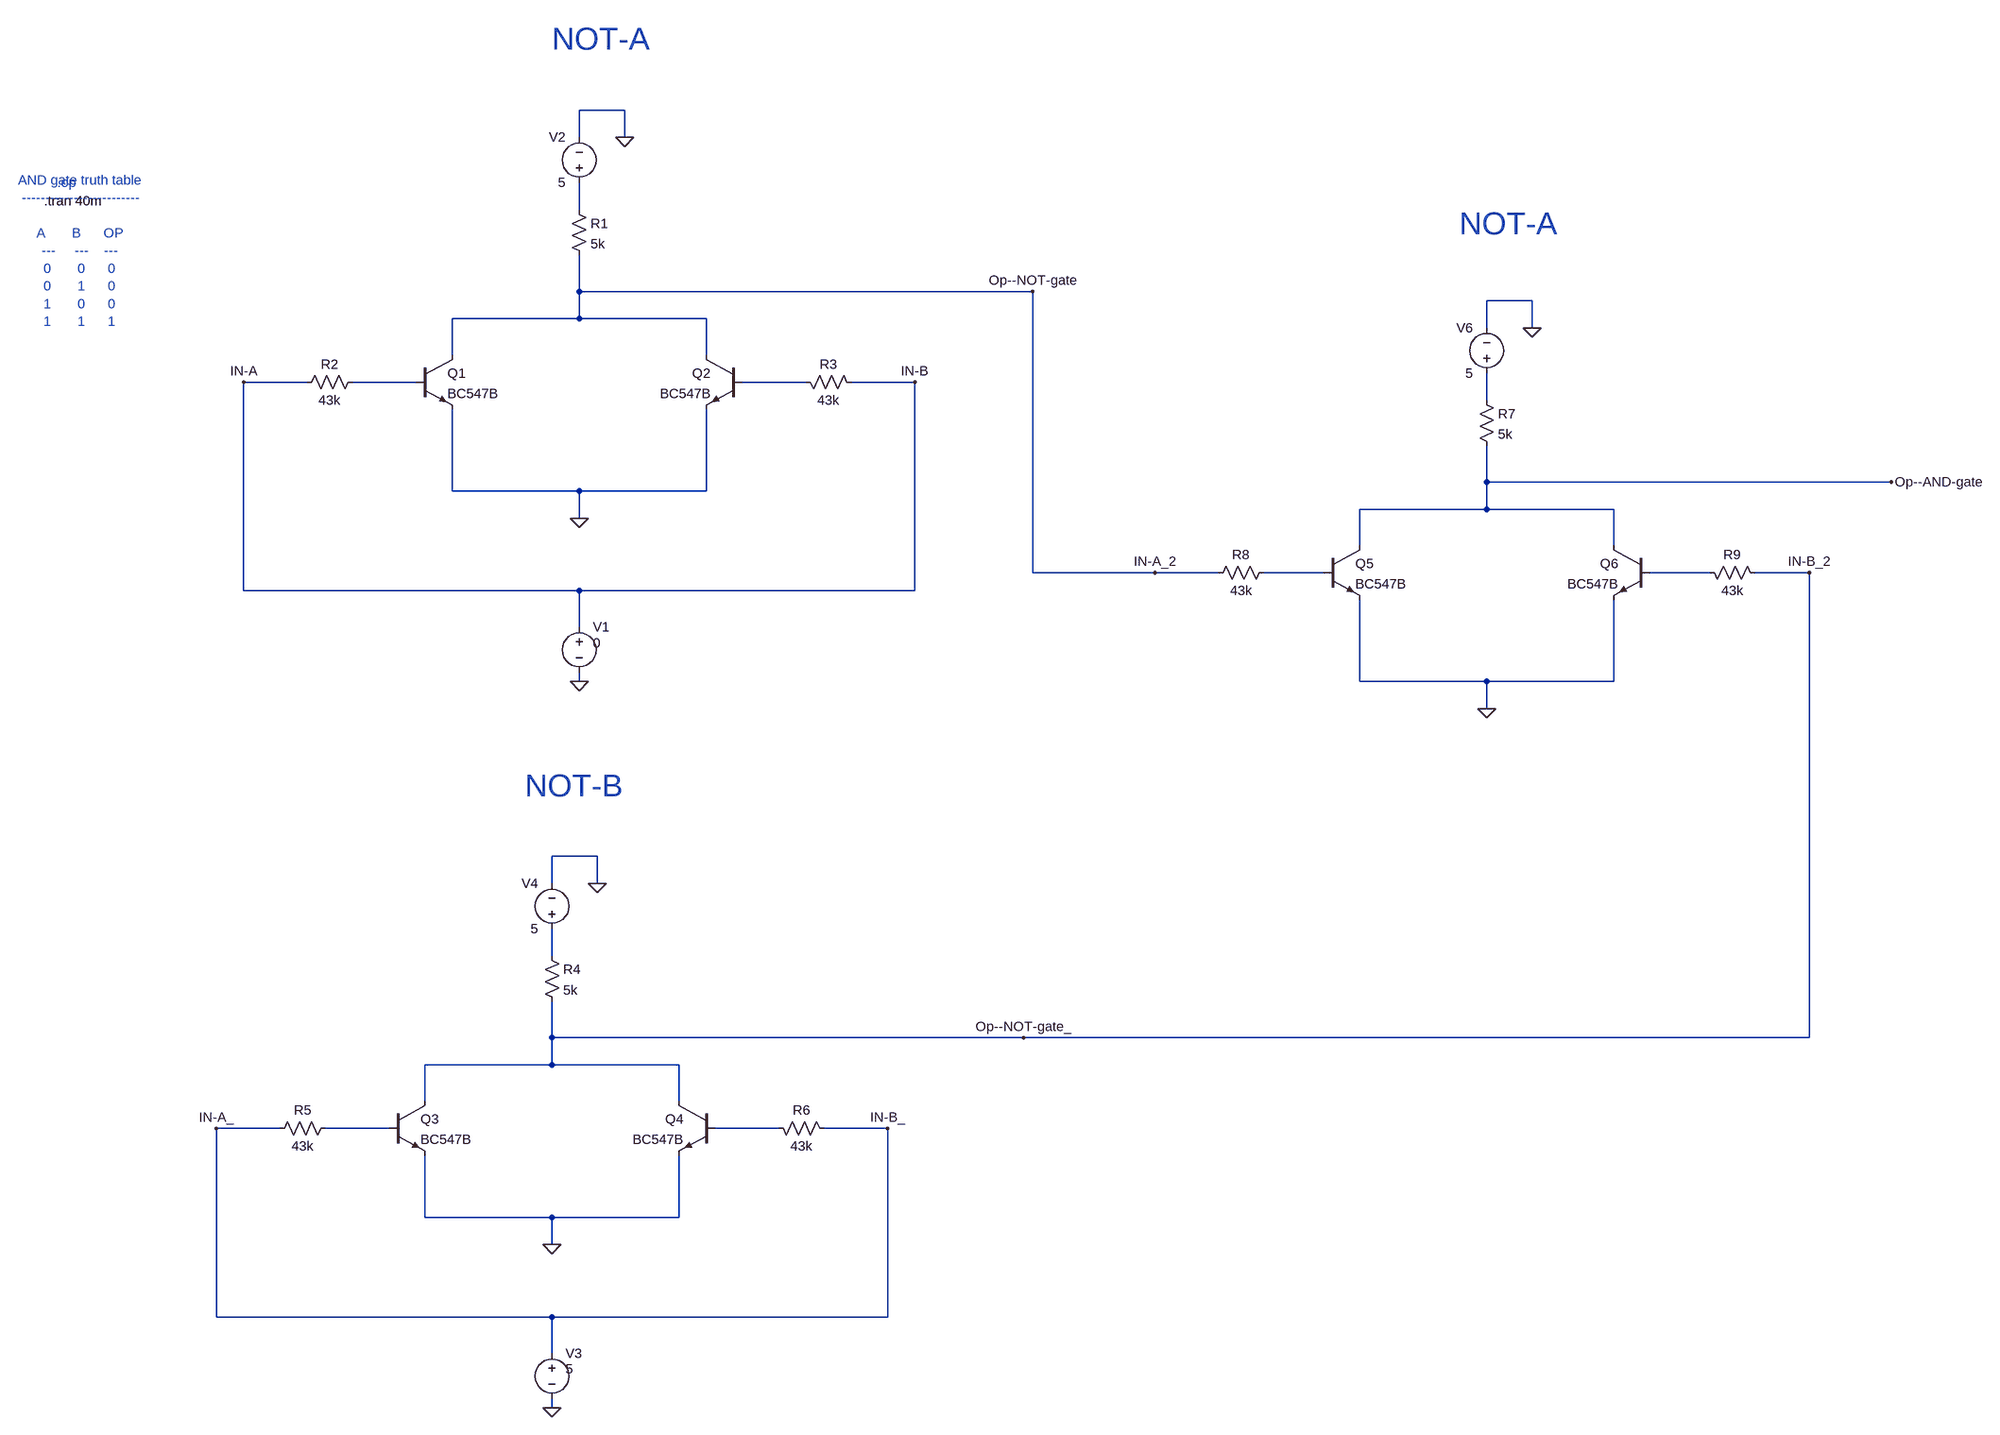
[diagram p0: schematic AND_using_NOR_gate.asc]
AND_using_NOR_gate.asc, the LTspice schematic file:
Version 4.1
SHEET 1 3684 2276
WIRE 656 -80 576 -80
WIRE 576 -32 576 -80
WIRE 656 -32 656 -80
WIRE 576 96 576 48
WIRE 576 240 576 176
WIRE 1376 240 576 240
WIRE 2752 256 2672 256
WIRE 576 288 576 240
WIRE 576 288 352 288
WIRE 800 288 576 288
WIRE 2672 304 2672 256
WIRE 2752 304 2752 256
WIRE 352 352 352 288
WIRE 800 352 800 288
WIRE 96 400 -16 400
WIRE 288 400 176 400
WIRE 976 400 864 400
WIRE 1168 400 1056 400
WIRE 2672 432 2672 384
WIRE 2672 576 2672 512
WIRE 3504 576 2672 576
WIRE 352 592 352 448
WIRE 576 592 352 592
WIRE 800 592 800 448
WIRE 800 592 576 592
WIRE 2672 624 2672 576
WIRE 2672 624 2448 624
WIRE 2896 624 2672 624
WIRE 576 640 576 592
WIRE 2448 688 2448 624
WIRE 2896 688 2896 624
WIRE 1376 736 1376 240
WIRE 2080 736 1376 736
WIRE 2192 736 2080 736
WIRE 2384 736 2272 736
WIRE 3072 736 2960 736
WIRE 3248 736 3152 736
WIRE -16 768 -16 400
WIRE 576 768 -16 768
WIRE 1168 768 1168 400
WIRE 1168 768 576 768
WIRE 576 832 576 768
WIRE 576 928 576 912
WIRE 2448 928 2448 784
WIRE 2672 928 2448 928
WIRE 2896 928 2896 784
WIRE 2896 928 2672 928
WIRE 2672 976 2672 928
WIRE 608 1248 528 1248
WIRE 528 1296 528 1248
WIRE 608 1296 608 1248
WIRE 528 1424 528 1376
WIRE 528 1568 528 1504
WIRE 1360 1568 528 1568
WIRE 3248 1568 3248 736
WIRE 3248 1568 1360 1568
WIRE 528 1616 528 1568
WIRE 528 1616 304 1616
WIRE 752 1616 528 1616
WIRE 304 1680 304 1616
WIRE 752 1680 752 1616
WIRE 48 1728 -64 1728
WIRE 240 1728 128 1728
WIRE 928 1728 816 1728
WIRE 1120 1728 1008 1728
WIRE 304 1920 304 1776
WIRE 528 1920 304 1920
WIRE 752 1920 752 1776
WIRE 752 1920 528 1920
WIRE 528 1968 528 1920
WIRE -64 2096 -64 1728
WIRE 528 2096 -64 2096
WIRE 1120 2096 1120 1728
WIRE 1120 2096 528 2096
WIRE 528 2160 528 2096
WIRE 528 2256 528 2240
FLAG -16 400 IN-A
FLAG 576 928 0
FLAG 1168 400 IN-B
FLAG 576 640 0
FLAG 656 -32 0
FLAG 1376 240 Op--NOT-gate
FLAG -64 1728 IN-A_
FLAG 528 2256 0
FLAG 1120 1728 IN-B_
FLAG 528 1968 0
FLAG 608 1296 0
FLAG 1360 1568 Op--NOT-gate_
FLAG 2080 736 IN-A_2
FLAG 3248 736 IN-B_2
FLAG 2672 976 0
FLAG 2752 304 0
FLAG 3504 576 Op--AND-gate
SYMBOL voltage 576 816 R0
WINDOW 3 24 44 Left 2
WINDOW 123 0 0 Left 0
WINDOW 39 0 0 Left 0
SYMATTR Value 0
SYMATTR InstName V1
SYMBOL npn 288 352 R0
SYMATTR InstName Q1
SYMATTR Value BC547B
SYMBOL voltage 576 64 R180
WINDOW 0 24 96 Left 2
WINDOW 3 24 16 Left 2
WINDOW 123 0 0 Left 0
WINDOW 39 0 0 Left 0
SYMATTR InstName V2
SYMATTR Value 5
SYMBOL res 560 80 R0
SYMATTR InstName R1
SYMATTR Value 5k
SYMBOL res 192 384 R90
WINDOW 0 0 56 VBottom 2
WINDOW 3 32 56 VTop 2
SYMATTR InstName R2
SYMATTR Value 43k
SYMBOL npn 864 352 M0
SYMATTR InstName Q2
SYMATTR Value BC547B
SYMBOL res 960 384 M90
WINDOW 0 0 56 VBottom 2
WINDOW 3 32 56 VTop 2
SYMATTR InstName R3
SYMATTR Value 43k
SYMBOL voltage 528 2144 R0
WINDOW 3 24 44 Left 2
WINDOW 123 0 0 Left 0
WINDOW 39 0 0 Left 0
SYMATTR Value 5
SYMATTR InstName V3
SYMBOL npn 240 1680 R0
SYMATTR InstName Q3
SYMATTR Value BC547B
SYMBOL voltage 528 1392 R180
WINDOW 0 24 96 Left 2
WINDOW 3 24 16 Left 2
WINDOW 123 0 0 Left 0
WINDOW 39 0 0 Left 0
SYMATTR InstName V4
SYMATTR Value 5
SYMBOL res 512 1408 R0
SYMATTR InstName R4
SYMATTR Value 5k
SYMBOL res 144 1712 R90
WINDOW 0 0 56 VBottom 2
WINDOW 3 32 56 VTop 2
SYMATTR InstName R5
SYMATTR Value 43k
SYMBOL npn 816 1680 M0
SYMATTR InstName Q4
SYMATTR Value BC547B
SYMBOL res 912 1712 M90
WINDOW 0 0 56 VBottom 2
WINDOW 3 32 56 VTop 2
SYMATTR InstName R6
SYMATTR Value 43k
SYMBOL npn 2384 688 R0
SYMATTR InstName Q5
SYMATTR Value BC547B
SYMBOL voltage 2672 400 R180
WINDOW 0 24 96 Left 2
WINDOW 3 24 16 Left 2
WINDOW 123 0 0 Left 0
WINDOW 39 0 0 Left 0
SYMATTR InstName V6
SYMATTR Value 5
SYMBOL res 2656 416 R0
SYMATTR InstName R7
SYMATTR Value 5k
SYMBOL res 2288 720 R90
WINDOW 0 0 56 VBottom 2
WINDOW 3 32 56 VTop 2
SYMATTR InstName R8
SYMATTR Value 43k
SYMBOL npn 2960 688 M0
SYMATTR InstName Q6
SYMATTR Value BC547B
SYMBOL res 3056 720 M90
WINDOW 0 0 56 VBottom 2
WINDOW 3 32 56 VTop 2
SYMATTR InstName R9
SYMATTR Value 43k
TEXT -800 80 Left 2 !.tran 40m
TEXT -776 48 Left 2 ;.op
TEXT -736 168 Center 2 ;AND gate truth table\n-------------------------\n \nA       B      OP\n---     ---    ---\n0       0      0\n0       1      0\n1       0      0\n1       1      1
TEXT 528 -216 Left 5 ;NOT-A
TEXT 480 1112 Left 5 ;NOT-B
TEXT 2624 120 Left 5 ;NOT-A

The netlist it stands for:
* AND_using_NOR_gate.asc
V1 IN-B 0 0
Q1 IN-A_2 N002 0 0 BC547B
V2 N001 0 5
R1 N001 IN-A_2 5k
R2 N002 IN-B 43k
Q2 IN-A_2 N003 0 0 BC547B
R3 N003 IN-B 43k
V3 IN-B_ 0 5
Q3 IN-B_2 N008 0 0 BC547B
V4 N007 0 5
R4 N007 IN-B_2 5k
R5 N008 IN-B_ 43k
Q4 IN-B_2 N009 0 0 BC547B
R6 N009 IN-B_ 43k
Q5 Op--AND-gate N005 0 0 BC547B
V6 N004 0 5
R7 N004 Op--AND-gate 5k
R8 N005 IN-A_2 43k
Q6 Op--AND-gate N006 0 0 BC547B
R9 N006 IN-B_2 43k
.model NPN NPN
.model PNP PNP
.lib standard.bjt
.tran 40m
* .op
* AND gate truth table
* -------------------------
* A       B      OP
* ---     ---    ---
* 0       0      0
* 0       1      0
* 1       0      0
* 1       1      1
* NOT-A
* NOT-B
* NOT-A
.backanno
.end